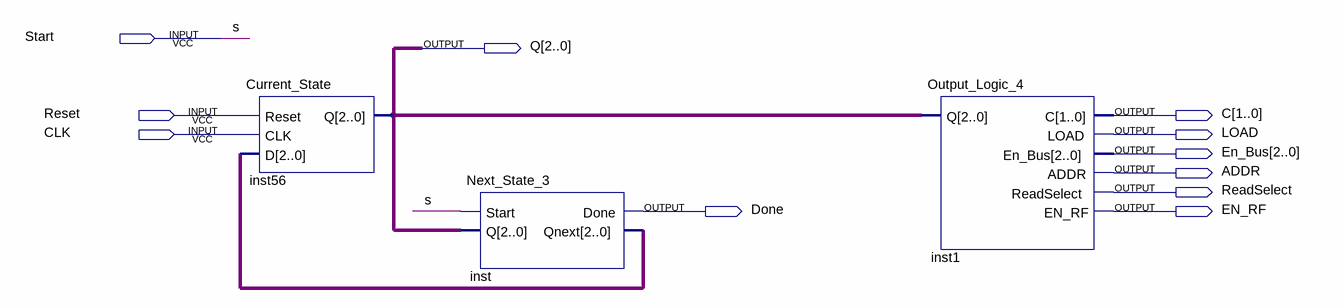
[diagram p0: schematic sheet]
// Quartus schematic Controller_4.bdf as structural Verilog: 3 symbols, 11 pins
module Controller_4 (
  input  Start,
  input  Reset,
  input  CLK,
  output [2:0] Q,
  output [1:0] C,
  output LOAD,
  output [2:0] En_Bus,
  output ADDR,
  output ReadSelect,
  output Done,
  output EN_RF
);

  wire [2:0] inst_qnext;

  Current_State inst56 (.Reset(Reset), .CLK(CLK), .D(inst_qnext), .Q(Q));
  Next_State_3 inst (.Start(Start), .Q(Q), .Done(Done), .Qnext(inst_qnext));
  Output_Logic_4 inst1 (
    .Q(Q), .C(C), .LOAD(LOAD), .En_Bus(En_Bus), .ADDR(ADDR), .ReadSelect(ReadSelect), .EN_RF(EN_RF));

  // Other names for the same wires on the sheet: s = Start
endmodule
